# EAGLE design untitled (EAGLE 9.1.3)
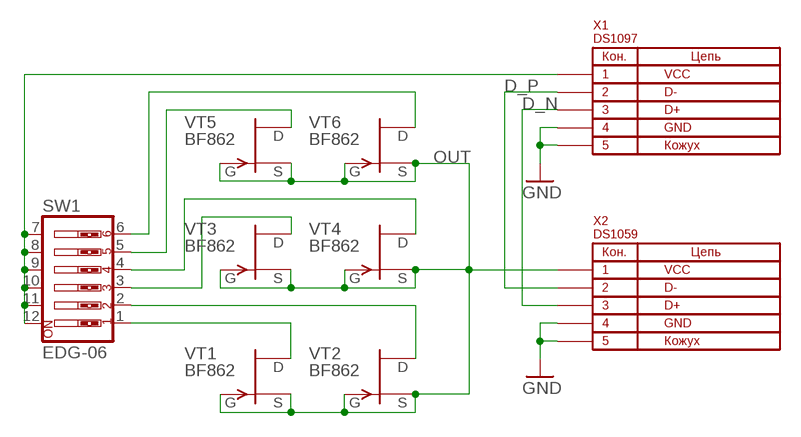
[diagram p0: schematic, sheet 1]

## Parts
SW1  EDG-06  [EDG-06]
VT1  BF862  [SOT23]
VT2  BF862  [SOT23]
VT3  BF862  [SOT23]
VT4  BF862  [SOT23]
VT5  BF862  [SOT23]
VT6  BF862  [SOT23]
X1  DS1097  [DS1097]
X2  DS1059  [DS1059]

## Nets
D_N [usb]: X1.P$2 X2.P$3
D_P [usb]: X1.P$3 X2.P$2
GND: X1.P$1 X1.P$5 X1.P$6 X2.P$4 X2.P$5 X2.P$6
N$1: SW1.6 VT6.2(D)
N$2: SW1.7 SW1.8 SW1.9 SW1.10 SW1.11 SW1.12 X1.P$4
N$3: SW1.5 VT5.2(D)
N$4: SW1.4 VT4.2(D)
N$5: SW1.3 VT3.2(D)
N$7: SW1.2 VT2.2(D)
N$8: SW1.1 VT1.2(D)
OUT: VT1.1(S) VT1.3(G) VT2.1(S) VT2.3(G) VT3.1(S) VT3.3(G) VT4.1(S) VT4.3(G) VT5.1(S) VT5.3(G) VT6.1(S) VT6.3(G) X2.P$1

## Library data of the parts
SW1 = untitled:EDG-06
VT1-VT6 = untitled:BF862
X1 = untitled:DS1097
X2 = untitled:DS1059

## Net classes
1 usb: width 0.7 mm, clearance 0.2 mm

## Board
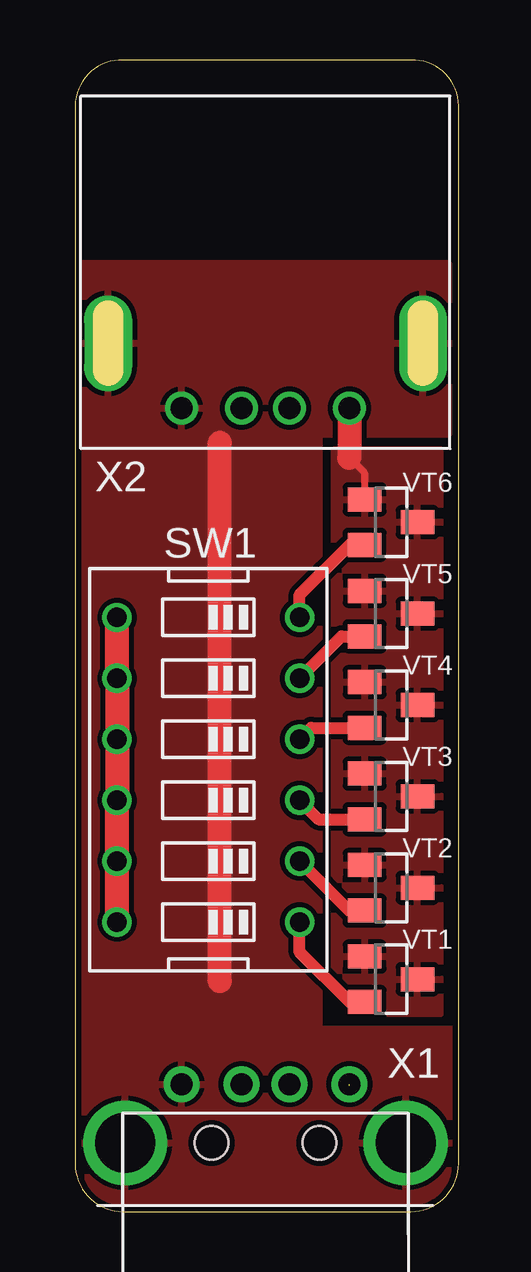
[diagram p1: board, top side]
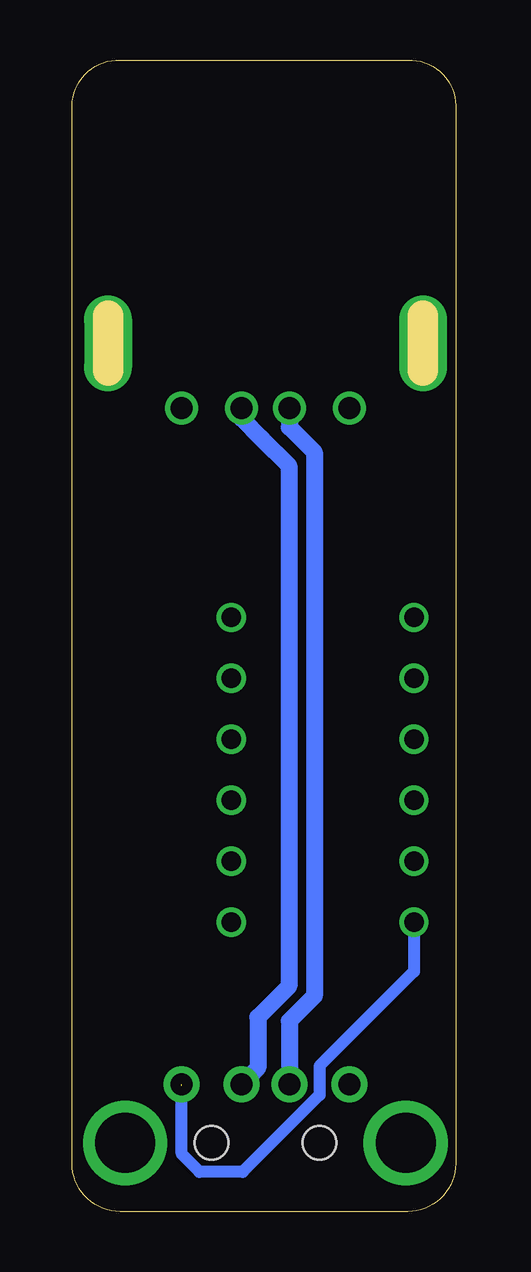
[diagram p2: board, bottom side, seen from below]

Size 16 x 48 mm. Coordinates in mm from the lower left corner, seen from the top.
Outline: 2,0 14,0 arc90 16,2 16,46.09 arc90 14,48 2,48 arc90 0,46.09 0,2 arc90 2,0
Copper layers (1*16): Top 0.035mm / dielectric 1.5mm / Bottom 0.035mm
Design rules "rezonit_2x0.35": minimum track width 8mil, minimum drill 0.3mm, track to track 8mil, track to pad 8mil, pad to pad 8mil, via to via 8mil, smd to smd 8mil, copper to edge 10mil, drill to drill 10mil, minimum pad ring 8mil, minimum via ring 6mil, stop-mask expansion 6mil, vias tented up to drill 0mil, thermal gap 8mil

### Footprints (pad centres in the part's own frame; a part is rotated, then mirrored left to right if it is on the bottom)
EDG-06 = drill 0.813: 1 -6.35,-3.81; 2 -3.81,-3.81; 3 -1.27,-3.81; 4 1.27,-3.81; 5 3.81,-3.81; 6 6.35,-3.81; 7 6.35,3.81; 8 3.81,3.81; 9 1.27,3.81; 10 -1.27,3.81; 11 -3.81,3.81; 12 -6.35,3.81
SOT23 = smd 1 x 1.4: 1 -0.95,-1.1; 2 0.95,-1.1; 3 0,1.1
DS1097 = drill 0.92 pad 1.5: P$1 -3.5,2.45; P$2 -1,2.45; P$3 1,2.45; P$4 3.5,2.45 | drill 2.5: P$5 -5.85,0; P$6 5.85,0 | hole 1.4: -2.25,0; 2.25,0
DS1059 = drill 0.92: P$1 -3.5,2.71; P$2 -1,2.71; P$3 1,2.71; P$4 3.5,2.71 | drill 0.8 pad 2 long: P$5 -6.57,0; P$6 6.57,0

### Placement (x,y rotation side)
SW1  5.56,18.41 90 top
VT1  13.18,9.68 270 top
VT2  13.18,13.49 270 top
VT3  13.18,17.3 270 top
VT4  13.18,21.11 270 top
VT5  13.18,24.92 270 top
VT6  13.18,28.73 270 top
X1  7.94,2.86 0 top
X2  7.94,36.2 180 top

### Tracks (layer width: path | path; a pad name or v marks a point on that pad's centre or on a via)
D_N
  Bottom 0.7: 5.9,8.98 5.9,31.65 6.94,32.69 X2.P$3 | 5.9,8.98 | 5.9,8.98 6.94,7.94 X1.P$2
D_P
  Bottom 0.7: X1.P$3 8.26,5.99 8.26,8.1 6.96,9.39 6.96,31.09 8.1,32.23 8.94,33.07 X2.P$2
GND
  Top 0.5: X1.P$1
  Top 1: 6.03,9.6 6.03,32.05
  pour Top: 0.32,7.62 15.72,7.62 15.72,-0.16 0.32,-0.16
  pour Top: 0.32,1.43 0.32,39.53 15.56,39.53 15.56,32.38 10.16,32.38 10.16,1.43
N$1
  Top 0.5: SW1.6 9.37,25.71 11.44,27.78 VT6.2
N$2  (1 unrouted)
  Top 1: SW1.12 SW1.11 SW1.10 SW1.9 SW1.8 SW1.7
  Bottom 0.5: SW1.12 1.75,10 5.68,6.06 5.68,4.86 8.89,1.65 10.69,1.65 11.43,2.4 11.43,5.24
N$3
  Top 0.5: SW1.5 11.12,23.97 VT5.2
N$4
  Top 0.5: SW1.4 9.85,20.16 VT4.2
N$5
  Top 0.5: SW1.3 10.16,16.35 VT3.2
N$7
  Top 0.5: SW1.2 11.43,12.54 VT2.2
N$8
  Top 0.5: SW1.1 9.37,10.81 11.44,8.73 VT1.2
OUT
  Top 0.3: 11.44,31.43 12.06,30.8 12.06,29.7
  Top 1: X2.P$1 11.44,31.43 | 12.06,29.7 VT6.1
  pour Top: 10.79,8.26 15.24,8.26 15.24,31.75 10.79,31.75